# Altium schematic sheet Sheet_V1.0.0.SchDoc
size A4
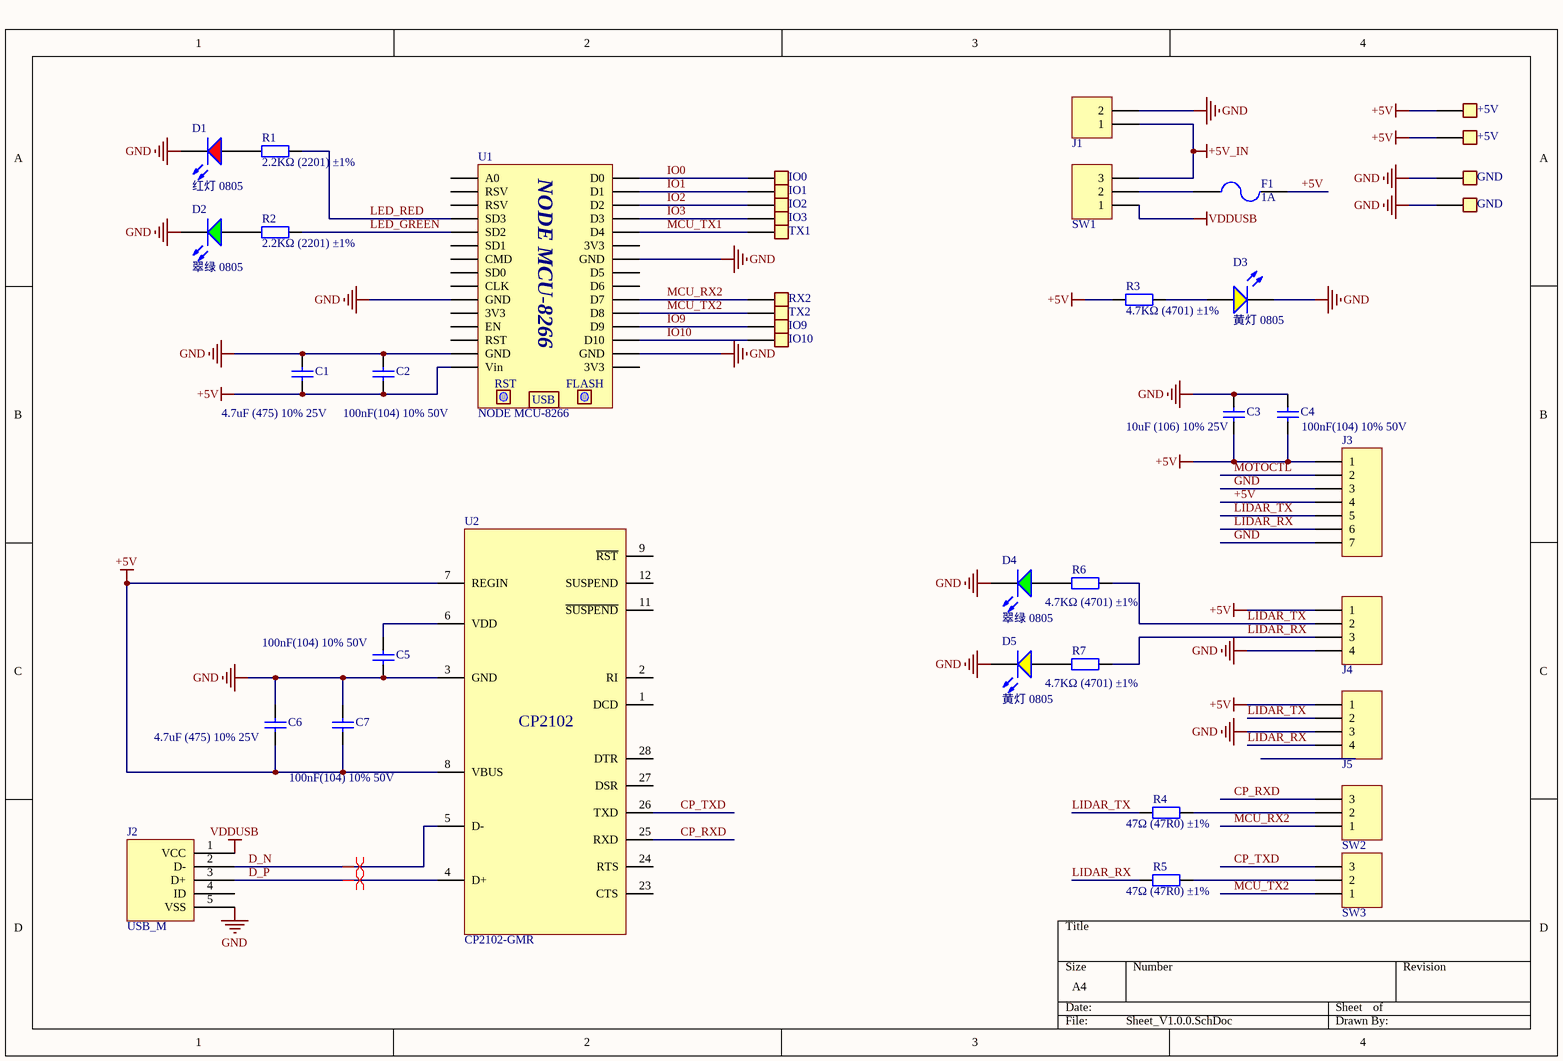
[diagram p0: Sheet_V1.0.0.SchDoc]

## Parts
C1  4.7uF (475) 10% 25V  [0805_C]
C2  100nF(104) 10% 50V  [0805_C]
C3  10uF (106) 10% 25V  [0805_C]
C4  100nF(104) 10% 50V  [0805_C]
C5  100nF(104) 10% 50V  [0805_C]
C6  4.7uF (475) 10% 25V  [0805_C]
C7  100nF(104) 10% 50V  [0805_C]
D1  红灯 0805  [0805_LED_S1]
D2  翠绿 0805  [0805_LED_S1]
D3  黄灯 0805  [0805_LED_S1]
D4  翠绿 0805  [0805_LED_S1]
D5  黄灯 0805  [0805_LED_S1]
F1  value 1A  [1812]  (hidden comment: Fuse)
J1  Header 2  [MKDS3_2RMM]  (value not drawn)
J2  USB_M  [USB-MICRO-A]
J3  Header 7  [5267-7A]  (value not drawn)
J4  Header 4  [PH2.0-4P]  (value not drawn)
J5  Header 4  (value not drawn)
R1  2.2KΩ (2201) ±1%  [0805_R]
R2  2.2KΩ (2201) ±1%  [0805_R]
R3  4.7KΩ (4701) ±1%  [0805_R]
R4  47Ω (47R0) ±1%  [0805_R]
R5  47Ω (47R0) ±1%  [0805_R]
R6  4.7KΩ (4701) ±1%  [0805_R]
R7  4.7KΩ (4701) ±1%  [0805_R]
SW1  Header 3  [HDR3X1_A]  (value not drawn)
SW2  Header 3  [HDR3X1_A]  (value not drawn)
SW3  Header 3  [HDR3X1_A]  (value not drawn)
TP0  IO0  [CHECK-A]
TP1  IO1  [CHECK-A]
TP2  IO2  [CHECK-A]
TP3  IO3  [CHECK-A]
TP9  IO9  [CHECK-A]
TP10  IO10  [CHECK-A]
TP11  TX1  [CHECK-A]
TP12  RX2  [CHECK-A]
TP13  TX2  [CHECK-A]
TP14  +5V  [CHECK-A]
TP15  +5V  [CHECK-A]
TP16  GND  [CHECK-A]
TP17  GND  [CHECK-A]
U1  NODE MCU-8266  [ESP8266_CP2102]
U2  CP2102-GMR  [QFN-28_5x5x05P]

## Nets
+5V: C1.1 C2.1 C3.1 C4.1 C6.1 C7.1 F1.2 J3.1 J3.4 J4.1 J5.1 R3.1 TP14.1 TP15.1 U1.15(Vin) U2.7(REGIN) U2.8(VBUS)
+5V_IN: J1.1 SW1.3
GND: C1.2 C2.2 C3.2 C4.2 C5.1 C6.2 C7.2 D1.K D2.K D3.K D4.K D5.K J1.2 J2.5(VSS) J3.3 J3.7 J4.4 J5.3 TP16.1 TP17.1 U1.10(GND) U1.14(GND) U1.17(GND) U1.24(GND) U2.3(GND)
VDDUSB: J2.1(VCC) SW1.1
CP_RXD: SW2.3 U2.25(RXD)
CP_TXD: SW3.3 U2.26(TXD)
D_N: J2.2(D-) U2.5(D-)
D_P: J2.3(D+) U2.4(D+)
IO0: TP0.1 U1.30(D0)
IO1: TP1.1 U1.29(D1)
IO2: TP2.1 U1.28(D2)
IO3: TP3.1 U1.27(D3)
IO9: TP9.1 U1.19(D9)
IO10: TP10.1 U1.18(D10)
LED_GREEN: R2.1 U1.5(SD2)
LED_RED: R1.1 U1.4(SD3)
LIDAR_RX: J3.6 J4.3 J5.4 R5.1 R7.1
LIDAR_TX: J3.5 J4.2 J5.2 R4.1 R6.1
MCU_RX2: SW2.1 TP12.1 U1.21(D7)
MCU_TX1: TP11.1 U1.26(D4)
MCU_TX2: SW3.1 TP13.1 U1.20(D8)
MOTOCTL: J3.2
NetC5_2: C5.2 U2.6(VDD)
NetD1_A: D1.A R1.2
NetD2_A: D2.A R2.2
NetD3_A: D3.A R3.2
NetD4_A: D4.A R6.2
NetD5_A: D5.A R7.2
NetF1_1: F1.1 SW1.2
NetR4_2: R4.2 SW2.2
NetR5_2: R5.2 SW3.2

Not connected (* = marked no-connect by the designer): J2 4(ID); U1 1(A0) 2(RSV) 3(RSV) 6(SD1) 7(CMD) 8(SD0) 9(CLK) 11(3V3) 12(EN) 13(RST) 16(3V3) 22(D6) 23(D5) 25(3V3); U2 1(DCD) 2(RI) 9(~{RST}) 11(~{SUSPEND}) 12(SUSPEND) 23(CTS) 24(RTS) 27(DSR) 28(DTR)

## Layout directives
differential pair: D_N, D_P

## Notes on the sheet
- (in symbol CP2102-GMR_[C6568]) CP2102
- (in symbol NodeMCU_8266) FLASH; USB

## Library data of the parts
C1 C6 = 0805 4.7uF (475) 10% 25V: 贴片电容; ComponentLink1Description: 供应商链接; ComponentLink1URL: http://www.szlcsc.com/product/details_2131.html; Package: 0805; Supplier: LC; SuppliersPartNumber: C1779
C2 C4 C5 C7 = 0805 100nF(104) 10% 50V: 贴片电容; ComponentLink1Description: 供应商链接; ComponentLink1URL: http://www.szlcsc.com/product/details_50686.html; Package: 0805; Supplier: LC; SuppliersPartNumber: C49678
C3 = 0805 10uF (106) 10% 25V: 贴片电容; ComponentLink1Description: 供应商链接; ComponentLink1URL: http://www.szlcsc.com/product/details_16532.html; Package: 0805; Supplier: LC; SuppliersPartNumber: C15850
D1 = 0805 红灯: 发光二极管; ComponentLink1Description: 供应商链接; ComponentLink1URL: http://www.szlcsc.com/product/details_2668.html; Package: 0805; Supplier: LC; SuppliersPartNumber: C2295
D2 D4 = 0805 翠绿: 发光二极管; ComponentLink1Description: 供应商链接; ComponentLink1URL: http://www.szlcsc.com/product/details_2670.html; Package: 0805; Supplier: LC; SuppliersPartNumber: C2297
D3 D5 = 0805 黄灯: 发光二极管; ComponentLink1Description: 供应商链接; ComponentLink1URL: http://www.szlcsc.com/product/details_2669.html; Package: 0805; Supplier: LC; SuppliersPartNumber: C2296
F1 = Fuse 2: 保险丝; Published: 8-Jun-2000; LatestRevisionDate: 17-Jul-2002; LatestRevisionNote: Re-released for DXP Platform.; PackageReference: PIN-W2/E2.8; Publisher: Altium Limited
J1 = Header 2: 接插件; LatestRevisionDate: 17-Jul-2002; LatestRevisionNote: Re-released for DXP Platform.; Publisher: Altium Limited
J2 = USB_M: MicroUSB接口
J3 = Header 7: Header, 7-Pin; LatestRevisionDate: 17-Jul-2002; LatestRevisionNote: Re-released for DXP Platform.; Publisher: Altium Limited
J4 J5 = Header 4: 接插件; LatestRevisionDate: 17-Jul-2002; LatestRevisionNote: Re-released for DXP Platform.; Publisher: Altium Limited
R1 R2 = 0805 2.2KΩ (2201) 1%: 贴片电阻; ComponentLink1Description: 供应商链接; ComponentLink1URL: http://www.szlcsc.com/product/details_18208.html; Package: 0805; Supplier: LC; SuppliersPartNumber: C17520
R3 R6 R7 = 0805 4.7KΩ (4701) 1%: 贴片电阻; ComponentLink1Description: 供应商链接; ComponentLink1URL: http://www.szlcsc.com/product/details_18361.html; Package: 0805; Supplier: LC; SuppliersPartNumber: C17673
R4 R5 = 0805 47Ω (47R0) 1%: 贴片电阻; ComponentLink1Description: 供应商链接; ComponentLink1URL: http://www.szlcsc.com/product/details_18402.html; Package: 0805; Supplier: LC; SuppliersPartNumber: C17714
SW1-SW3 = Header 3: 接插件; LatestRevisionDate: 17-Jul-2002; LatestRevisionNote: Re-released for DXP Platform.; Publisher: Altium Limited
TP0-TP3 TP9-TP17 = TP
U1 = NodeMCU_8266
U2 = CP2102-GMR_[C6568]: USB; ComponentLink1Description: 供应商链接; ComponentLink1URL: http://www.szlcsc.com/product/details_7033.html; Package: QFN-28_5x5x05P; Supplier: LC; SuppliersPartNumber: C6568